# Altium schematic sheet TopSheet.SchDoc
size A4; CompanyName: Technische Hochschule Nürnberg Georg Simon Ohm; Organization: UltraZohm; Address1: Kesslerplatz 12; Address2: 90489 Nürnberg; Address3: GERMANY; DocumentNumber: 1; SheetNumber: 1; SheetTotal: 3; Website: www.ultrazohm.com
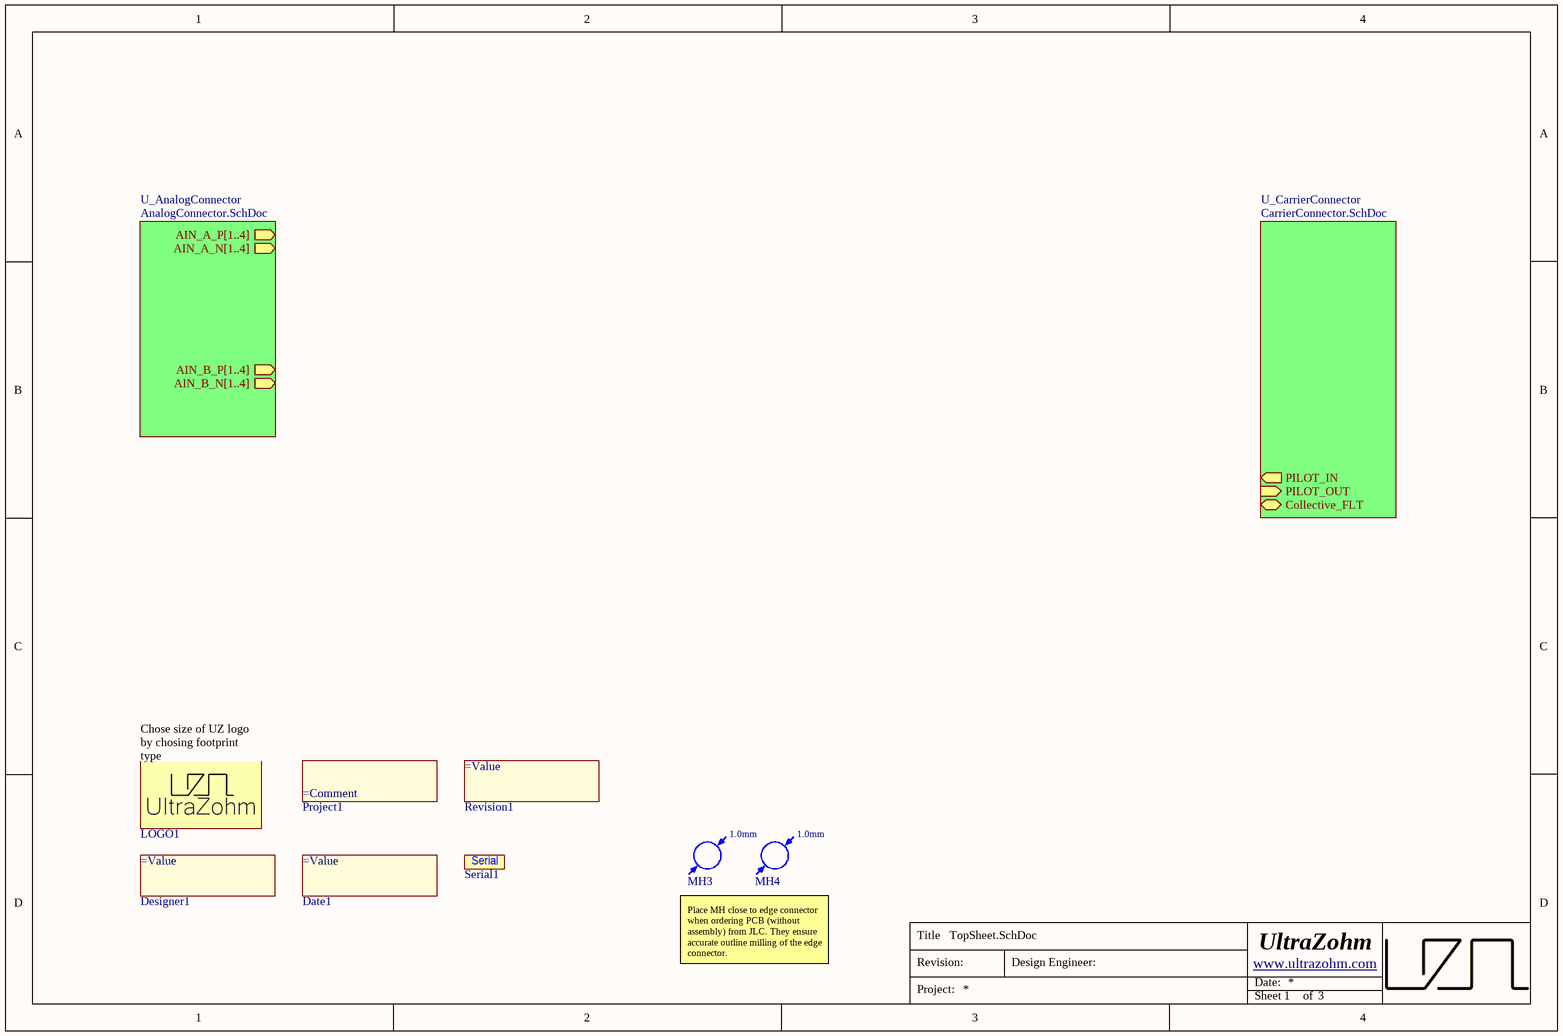
[diagram p0: TopSheet.SchDoc]

## Parts
Date1  (no value)  [COMMENT]  (no BOM)
Designer1  (no value)  [Designator:comment]  (no BOM)
LOGO1  UZ Logo  [UZ_Logo_small]  (value not drawn)  (no BOM)
MH3  alignment hole 1mm  [MH_1]  (value not drawn)
MH4  alignment hole 1mm  [MH_1]  (value not drawn)
Project1  (no value)  [COMMENT]  (no BOM)
Revision1  (no value)  [Designator:comment]  (no BOM)
Serial1  Serial #  [SERIAL]  (value not drawn)

## Sub-sheets
U_AnalogConnector = AnalogConnector.SchDoc: AIN_B_P[1..4] (out), AIN_B_N[1..4] (out), AIN_A_N[1..4] (out), AIN_A_P[1..4] (out)
U_CarrierConnector = CarrierConnector.SchDoc: PILOT_OUT (in), PILOT_IN (out), Collective_FLT (bidir)

## Notes on the sheet
- (near LOGO1) Chose size of UZ logo by chosing footprint type
- Place MH close to edge connector when ordering PCB (without assembly) from JLC. They ensure accurate outline milling of the edge connector.
- Title
- Revision:
- Design Engineer:
- Date:
- Project:
- Sheet
- of
- (in symbol 6) Serial
- (in symbol Mounting Hole - 1mm) 1.0mm

## Library data of the parts
Date1 = 5: Create a project parameter named "FinDate" this is the value of this component. It is printed on the PCB. Once the parameter is updated (e.g. new revision) it gets updated on the PCB as well; Manufacturer: PCB Manufacturer; Manufacturer Part Number: Project End Date; Created from: T. Wendt; PartID: 5; Created On: 01.03.2021 09:01:41; Component Type: Date of Project Finalization; Last Updated: 01.03.2021 09:01:41; Type: Standard (No BOM); Value: =FinDate; Live Cycle Status: 1
Designer1 = 4: Create a project parameter named "Author" this is the value of this component. It is printed on the PCB. Once the parameter is updated (e.g. new revision) it gets updated on the PCB as well; Manufacturer: PCB Manufacturer; Manufacturer Part Number: Project Author; Created from: T. Wendt; PartID: 4; Created On: 01.03.2021 08:53:41; Component Type: Project Author; Last Updated: 01.03.2021 09:20:27; Type: Standard (No BOM); Value: =AuthorParam; Live Cycle Status: 1
LOGO1 = 1: Official Project Logo of the UltraZohm; Manufacturer: PCB Manufacturer; Manufacturer Part Number: UltraZohm Logo; Created from: T. Wendt; PartID: 1; Created On: 19.02.2021 16:55:56; ComponentLink1Description: Homepage; ComponentLink1URL: https://ultrazohm.com; Component Type: Logo; Last Updated: 02.03.2021 14:31:24; Type: Standard (No BOM); Live Cycle Status: 1
MH3 MH4 = Mounting Hole - 1mm: Non plated through hole, 1mm
Project1 = 2: Create a project parameter named "ProjectNameCustom" this is the value of this component and it is printed on the PCB.; Manufacturer: PCB Manufacturer; Created from: T. Wendt; PartID: 2; Created On: 01.03.2021 08:43:57; Component Type: Project Name; Last Updated: 01.03.2021 09:07:27; Manufacturer Part Number: Project Name; Type: Standard (No BOM); Value: =ProjectNameCustom; Live Cycle Status: 1
Revision1 = 3: Create a project parameter named "ProjectRevision" this is the value of this component. It is printed on the PCB. Once the parameter is updated (e.g. new revision) it gets updated on the PCB as well; Manufacturer: PCB Manufacturer; Created from: T. Wendt; PartID: 3; Created On: 01.03.2021 08:50:34; Component Type: Project Revision; Last Updated: 01.03.2021 09:28:36; Manufacturer Part Number: Project Revision; Type: Standard (No BOM); Value: =ProjectRevision; Live Cycle Status: 1
Serial1 = 6: Field to put in a serial number; Manufacturer: PCB Manufacturer; Created from: T. Wendt; PartID: 6; Created On: 02.03.2021 14:31:24; Component Type: Serial Number; Last Updated: 02.03.2021 14:31:24; Manufacturer Part Number: Serial Number; Type: Standard (No BOM); Live Cycle Status: 1